# Altium schematic sheet 2019-08-14_06-14-561.schdoc
size 294 x 133 mm; SheetNumber: 1; SheetTotal: 1
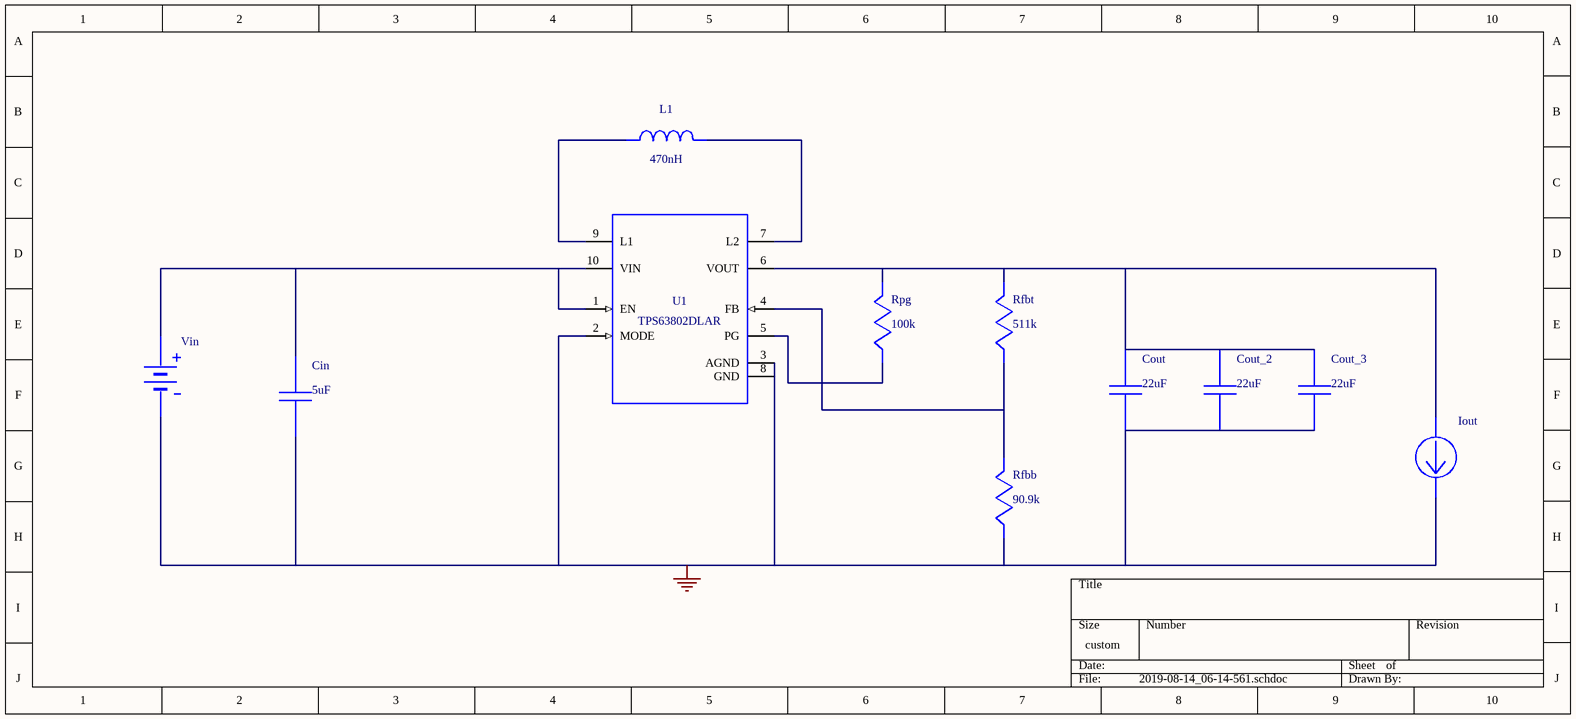
[diagram p0: 2019-08-14_06-14-561.schdoc]

## Parts
Cin  value 5uF  (hidden comment: GENERIC_CAPACITOR)
Cout  value 22uF  (hidden comment: GRM21BR60J226ME39L)
Cout_2  value 22uF  (hidden comment: GRM21BR60J226ME39L)
Cout_3  value 22uF  (hidden comment: GRM21BR60J226ME39L)
Iout  WB_CURRENT_LOAD  (value not drawn)
L1  value 470nH  (hidden comment: XEL3520-471ME)
Rfbb  value 90.9k  (hidden comment: CRCW040290K9FKED)
Rfbt  value 511k  (hidden comment: CRCW0402511KFKED)
Rpg  value 100k  (hidden comment: CRCW0402100KFKED)
U1  TPS63802DLAR
Vin  WB_BATTERY  (value not drawn)

## Nets
0: Cin.2 Cout.2 Cout_2.2 Cout_3.2 Iout.2(-) Rfbb.2 U1.2(MODE) U1.3(AGND) U1.8(GND) Vin.2(-)
NetCin_1: Cin.1 U1.1(EN) U1.10(VIN) Vin.1(+)
NetCout_1: Cout.1 Cout_2.1 Cout_3.1 Iout.1(+) Rfbt.1 Rpg.1 U1.6(VOUT)
NetL1_1: L1.1 U1.7(L2)
NetL1_2: L1.2 U1.9(L1)
NetRfbb_1: Rfbb.1 Rfbt.2 U1.4(FB)
NetRpg_2: Rpg.2 U1.5(PG)

## Library data of the parts
Cin = GENERIC_CAPACITOR: CUSTOM1; Manufacturer Name: CUSTOM; PackageReference: CUSTOM; Manufacturer Part Number: GENERIC_CAPACITOR
Cout Cout_2 Cout_3 = GRM21BR60J226ME39L: GRM21BR60J226ME3; Manufacturer Name: MuRata; PackageReference: GRM21BR60J226ME39L; Manufacturer Part Number: GRM21BR60J226ME39L
L1 = XEL3520-471ME: Manufacturer Name: Coilcraft; PackageReference: XEL3520-471ME; Manufacturer Part Number: XEL3520-471ME
Rfbb = CRCW040290K9FKED: Manufacturer Name: Vishay-Dale; PackageReference: CRCW040290K9FKED; Manufacturer Part Number: CRCW040290K9FKED
Rfbt = CRCW0402511KFKED: Manufacturer Name: Vishay-Dale; PackageReference: CRCW0402511KFKED; Manufacturer Part Number: CRCW0402511KFKED
Rpg = CRCW0402100KFKED: Manufacturer Name: Vishay-Dale; PackageReference: CRCW0402100KFKED; Manufacturer Part Number: CRCW0402100KFKED
U1 = TPS63802DLAR: Manufacturer Name: Texas Instruments; PackageReference: TPS63802DLAR; Manufacturer Part Number: TPS63802DLAR; Value: N/A
Iout = WB_CURRENT_LOAD: PackageReference: WB_CURRENT_LOAD; Manufacturer Part Number: WB_CURRENT_LOAD; Manufacturer Name: WB_CURRENT_LOAD; Value: N/A
Vin = WB_BATTERY: PackageReference: WB_BATTERY; Manufacturer Part Number: WB_BATTERY; Manufacturer Name: WB_BATTERY; Value: N/A